# EAGLE design water_buzzer (EAGLE 9.4.2)
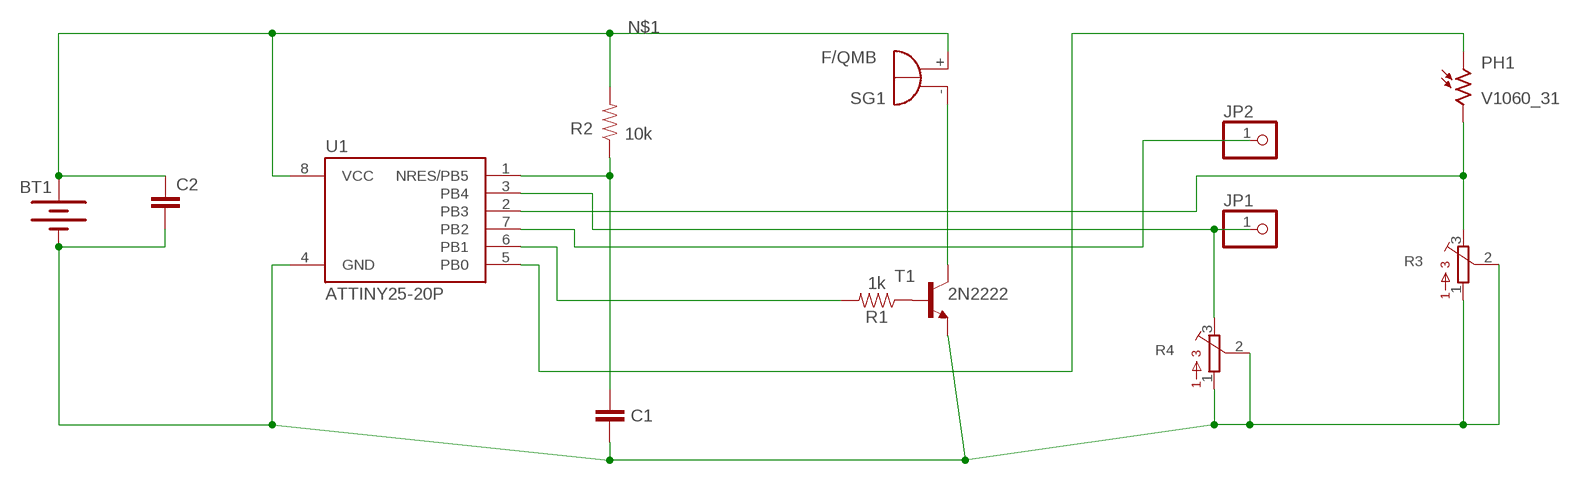
[diagram p0: schematic, sheet 1]

## Parts
BT1  BATTERY-20MM_PTH  [BATTCOM_20MM_PTH]
C1  C5/2.5  [C5B2.5]
C2  C5/2.5  [C5B2.5]
JP1  PINHD-1X1  [1X01]
JP2  PINHD-1X1  [1X01]
PH1  V1060_31  [TO-5_V10]
R1  1k  1KOHM-HORIZ-1/4W-5%  [AXIAL-0.3]
R2  10k  10KOHM-HORIZ-1/4W-5%  [AXIAL-0.3]
R3  3362R  [3362R]
R4  3362R  [3362R]
SG1  F/QMB  [F/QMB]
T1  2N2222  [TO92-EBC-OVAL]
U1  ATTINY25-20P  [PDIP08_300MIL]

## Nets
N$1: BT1.1(+) C2.1 R2.P$2 SG1.+(-) U1.8(VCC)
N$2: BT1.2(-) C1.1 C2.2 R3.1 R3.2 R4.1 R4.2 T1.E U1.4(GND)
N$3: C1.2 R2.P$1 U1.1(NRES/PB5)
N$4: JP2.1 U1.7(PB2)
N$5: R1.P$1 T1.B
N$6: JP1.1 R4.3 U1.3(PB4)
N$7: SG1.-(+) T1.C
N$8: R1.P$2 U1.6(PB1)
N$9: PH1.1 U1.5(PB0)
N$10: PH1.2 R3.3 U1.2(PB3)

## Library data of the parts
BT1 = SparkFun-Batteries:BATTERY: Battery - Single Cell A variety of battery chemistries, sizes, and footprints. Device List: 20MM_PTH - Coin Cell Battery Holder - 20mm (PTH) <https://www.sparkfun.com/products/783> 20MM_PTH_KIT- Coin Cell battery Holder - 20 mm (PTH) <http://www.sparkfun.com/products/783>kit version with special mask 6.8MM_PTH - Coin Cell Battery Holder - 6.8MM(SMD) <https://www.digikey.com/product-detail/en/seiko-instruments/MS621FE-FL11E/728-1057-ND/1889208?WT.srch=1&gclid=CNOQ5a6LzdQCFZS2wAodXCkE0g> 12MM_SMD - Coin Cell Battery Holder - 12mm (SMD) <https://www.sparkfun.com/products/10592> 12MM_PTH - Coin Cell Battery Holder - 12mm (PTH) <https://www.sparkfun.com/products/7948> 20MM_SMD - 20mm Coin Cell Battery Holder (SMD) (2 legs) Used on the Big Time Watch Kit <https://www.sparkfun.com/products/11734> 20MM_SMD_4LEGS - Coin Cell Battery Holder - 20mm (SMD) <https://www.sparkfun.com/products/11892> 20MM_SMD_4LEGS_OVERPASTE - Coin Cell Battery Holder - 20mm (SMD) <https://www.sparkfun.com/products/11892> (Over-paste on the legs) 24.5MM_PTH - Coin Cell Battery Holder - 24.5mm (PTH) <https://www.sparkfun.com/products/8863> 9V - 9V Battery Holder - PC Mount Used on the SparkFun SparkPunk Sound Kit <https://www.sparkfun.com/products/11177> and SparkFun SparkPunk Sequencer Kit <https://www.sparkfun.com/products/12707> 18650 - Battery Holder - 18650 (PTH) <https://www.sparkfun.com/products/13113> AA - Battery Holder - 1xAA (PTH) <https://www.sparkfun.com/products/7949> AAA - Battery Holder - 1xAAA (PTH) <https://www.sparkfun.com/products/12718> AA_KIT - Battery Holder - 1xAA (PTH) <https://www.sparkfun.com/products/7949> Special kit package - pads only have exposed copper on one side of the board. AAA_KIT - Battery Holder - 1xAAA (PTH) <https://www.sparkfun.com/products/12718> Special kit package - pads only have exposed copper on one side of the board.; PROD_ID: BATT-09031; SF_SKU: PRT-00783
C1 C2 = capacitor-wima:C: CAPACITOR naming: grid - package width
JP1 JP2 = adafruit:PINHD-1X1: Pin header 1x1 for 0.1" spacing With round pins
PH1 = photo-elements:?1060*: Sensor Street Light control Source: http://optoelectronics.perkinelmer.com/content/Datasheets/DTS_PhotocellsB1060.pdf
R1 = SparkFun-Resistors:1KOHM: 1kΩ resistor A resistor is a passive two-terminal electrical component that implements electrical resistance as a circuit element. Resistors act to reduce current flow, and, at the same time, act to lower voltage levels within circuits. - Wikipedia; PROD_ID: RES-08380
R2 = SparkFun-Resistors:10KOHM: 10kΩ resistor A resistor is a passive two-terminal electrical component that implements electrical resistance as a circuit element. Resistors act to reduce current flow, and, at the same time, act to lower voltage levels within circuits. - Wikipedia; PROD_ID: RES-09435
R3 R4 = bourns:3362: 3362 Series 1/4" Square Trimmer
SG1 = buzzer:F/QMB: BUZZER Source: Buerklin; OC_FARNELL: unknown; OC_NEWARK: unknown
T1 = adafruit:2N2222: NPN TRANSISTOR Big oval pads
U1 = _hhn_attiny25_45_85:ATTINY25*: ATMEL ATtiny 25 Packages: P = PDIP 08 30mil S = SOIC 08 EIAJ 208mil SS = SOIC 08 JEDEC 150mil Technologies Note: for complete ordering code (temp. range, finish, tape&reel etc.) see www.atmel.com • Supply Voltage: V = (1.8…5.5)V | [blank] = (2.7…5.5)V • Speed: 10 = 10 MHz | 20 = 20 MHz Author: Dipl.-Ing. FH Rainer Bayer HHN Hochschule Heilbronn (Heilbronn University), rainer.bayer@hs-heilbronn.de Ingenieurbüro ing-rb, mail@ing-rb.de

## Board
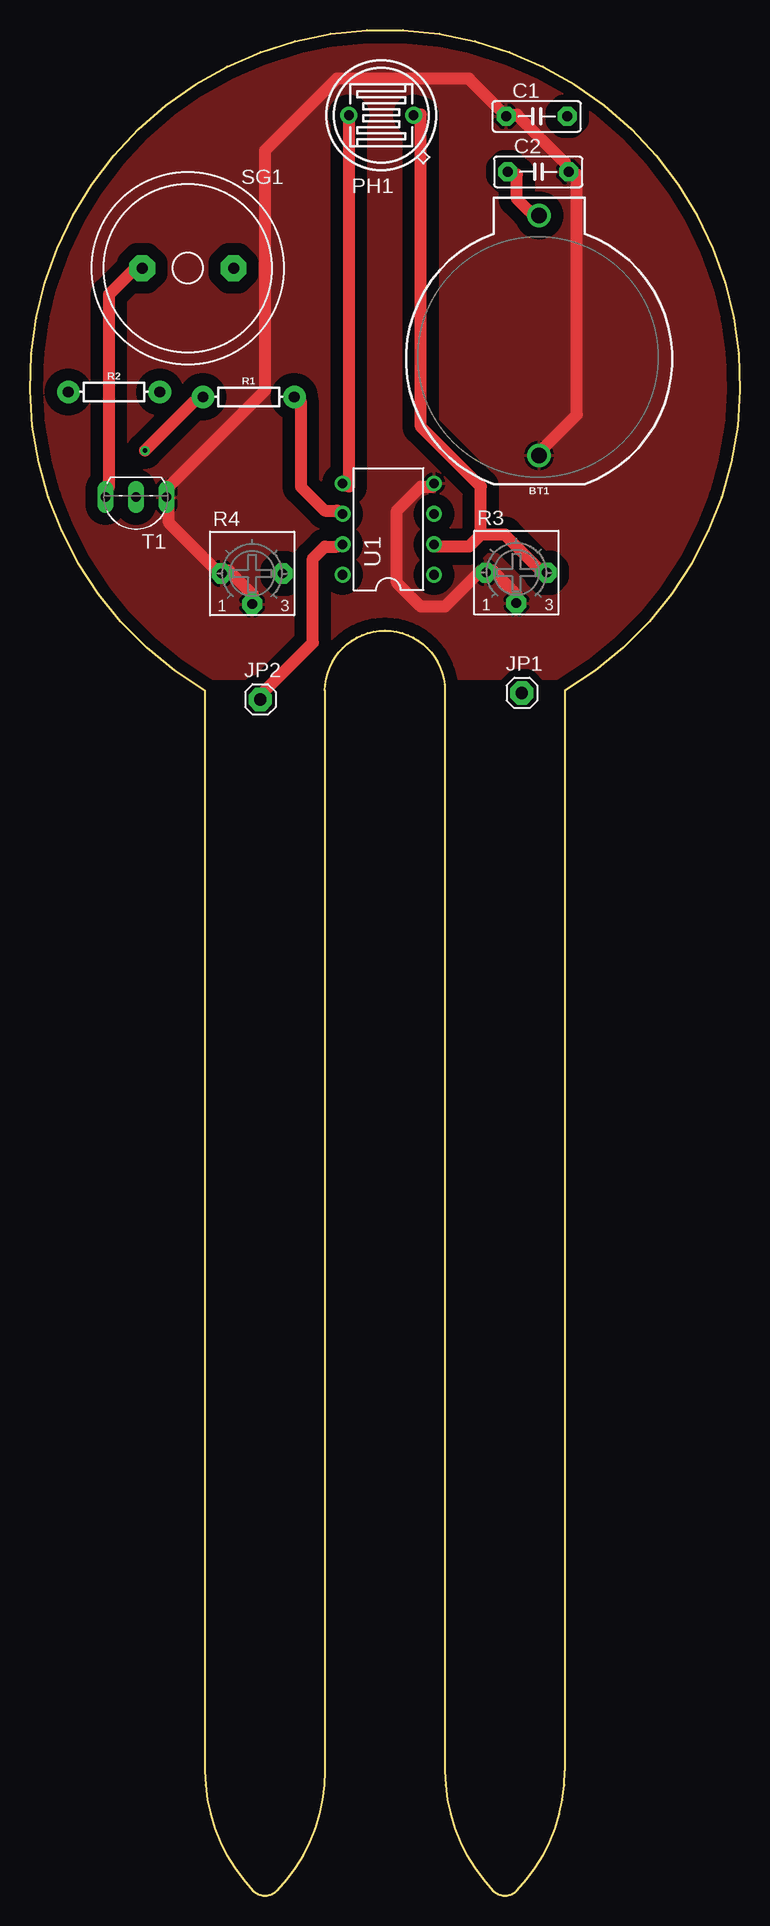
[diagram p1: board, top side]
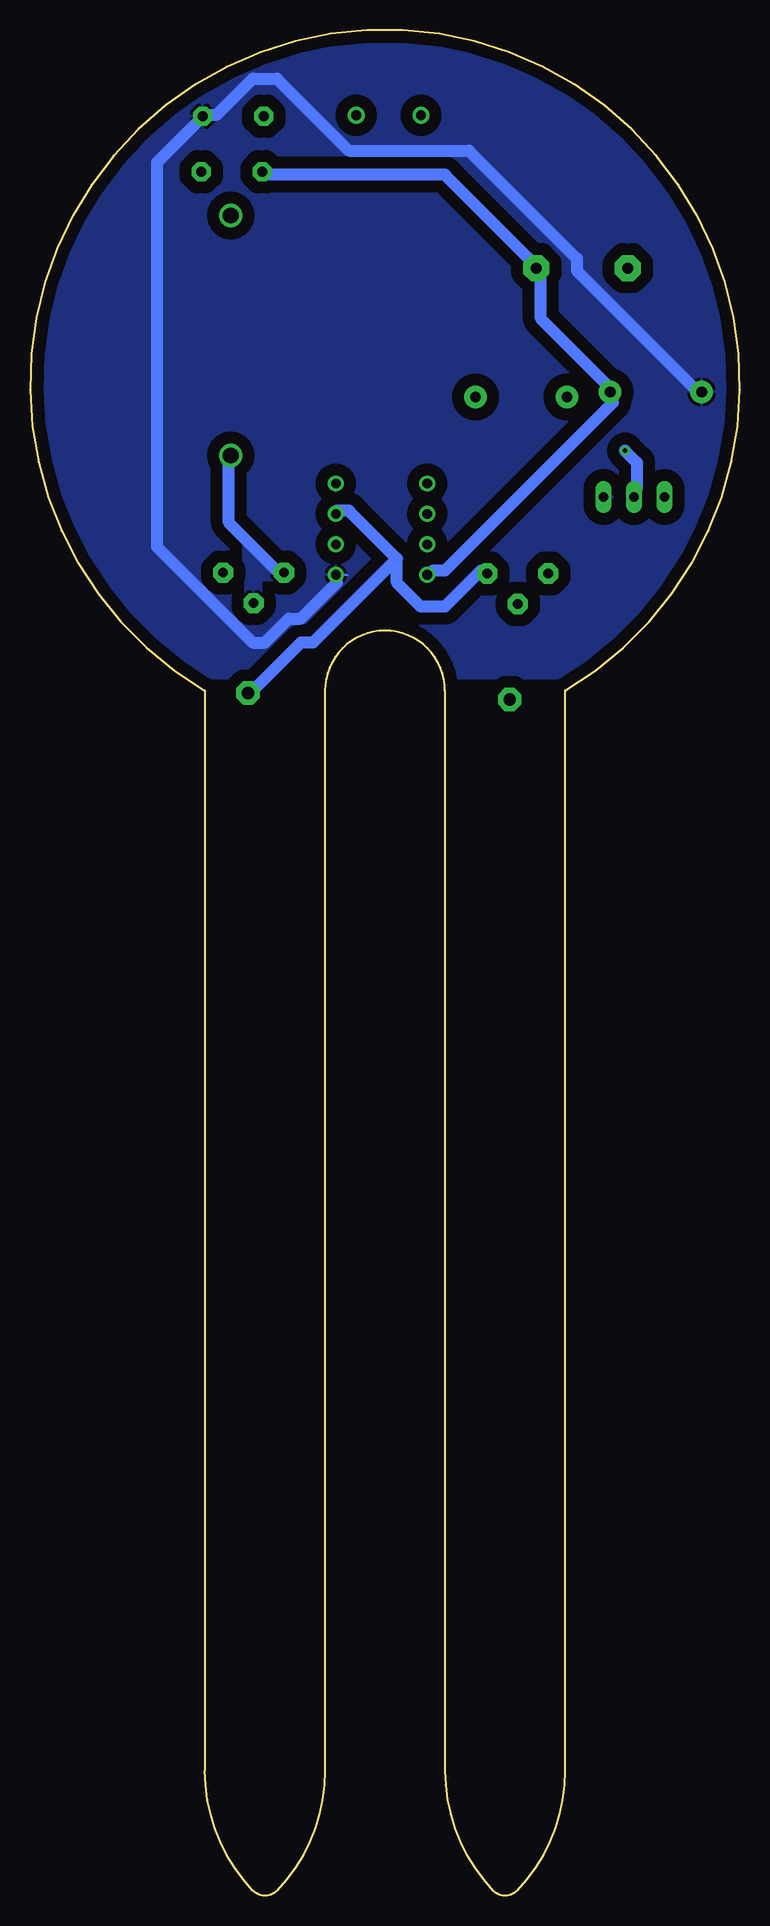
[diagram p2: board, bottom side, seen from below]

Size 59.16 x 155.47 mm. Coordinates in mm from the lower left corner, seen from the top.
Outline: 14.58,100.43 14.58,10.43 arc44 18.58,0.43 arc93 20.58,0.43 arc44 24.58,10.43 24.58,100.43 arc-180 34.58,100.43 34.58,10.43 arc44 38.58,0.43 arc93 40.58,0.43 arc44 44.58,10.43 44.58,100.43 arc299 14.58,100.43
Copper layers (1*16): Top 0.035mm / dielectric 1.5mm / Bottom 0.035mm
Design rules "default *": minimum track width 1mm, minimum drill 0.35mm, track to track 1mm, track to pad 1mm, pad to pad 6mil, via to via 6mil, smd to smd 6mil, copper to edge 1mm, drill to drill 1mm, minimum pad ring 10mil, minimum via ring 8mil, stop-mask expansion 4mil, vias tented up to drill 0mil, thermal gap 10mil

### Footprints (pad centres in the part's own frame; a part is rotated, then mirrored left to right if it is on the bottom)
BATTCOM_20MM_PTH = drill 1.3: 1 11.85,0; 2 -8.15,0
C5B2.5 = drill 0.813 pad 1.6 octagon: 1 -2.54,0; 2 2.54,0
1X01 = drill 1.016 pad 1.93 octagon: 1 0,0
TO-5_V10 = drill 0.8 pad 1.4: 1 -2.7,0; 2 2.7,0
AXIAL-0.3 = drill 0.9 pad 1.88: P$1 -3.81,0; P$2 3.81,0
3362R = drill 0.813 pad 1.676 octagon: 1 -2.54,0; 2 0,-2.54; 3 2.54,0
F/QMB = drill 0.914 pad 2.159 octagon: + 3.81,0; - -3.81,0
TO92-EBC-OVAL = drill 0.813 long: B 0,-1.27; C 2.54,-1.27; E -2.54,-1.27
PDIP08_300MIL = drill 0.813: 1 -3.81,-3.81; 2 -1.27,-3.81; 3 1.27,-3.81; 4 3.81,-3.81; 5 3.81,3.81; 6 1.27,3.81; 7 -1.27,3.81; 8 -3.81,3.81

### Placement (x,y rotation side)
BT1  42.43,128.17 90 top
C1  42.22,148.28 0 top
C2  42.35,143.66 0 top
JP1  40.99,100.23 0 top
JP2  19.19,99.69 0 top
PH1  29.27,148.37 0 top
R1  18.22,124.9 0 top
R2  7,125.31 0 top
R3  40.53,110.26 0 top
R4  18.51,110.18 0 top
SG1  13.15,135.63 0 top
T1  8.83,115.28 180 top
U1  29.86,113.88 90 top

### Tracks (layer width: path | path; a pad name or v marks a point on that pad's centre or on a via)
N$1
  Top 1: C2.1 40.58,143.43 40.58,141.43 41.58,140.43 BT1.1
  Bottom 0.152: 26.01,110.18 U1.8
  Bottom 1: U1.8 25.58,110.43 24.58,110.43 10.58,124.43 R2.P$2 10.58,125.43 16.58,131.43 16.58,135.43 SG1.+ 17.58,136.43 24.58,143.43 39.58,143.43 C2.1
N$2
  Top 0.152: 18.39,107.74 R4.2 | 16.11,110.03 R4.1 | 42.47,120.09 BT1.2 | 33.63,117.65 U1.4
  Top 1: R4.2 18.58,108.43 16.58,110.43 R4.1 15.58,110.43 11.58,114.43 11.58,116.43 T1.E 11.58,117.43 19.58,125.43 19.58,145.43 25.58,151.43 36.58,151.43 39.58,148.43 | 39.58,148.43 40.58,148.43 44.58,144.43 C2.2 45.58,143.43 45.58,123.43 42.58,120.43 BT1.2 | U1.4 33.58,117.43 32.58,117.43 30.58,115.43 30.58,109.43 32.58,107.43 34.58,107.43 37.58,110.43 R3.1 38.58,110.43 40.58,108.43 R3.2 | 39.58,148.43 C1.1
  Bottom 0.152: 33.78,117.65 U1.4 | 37.9,110.33 R3.1 | 42.32,119.93 BT1.2
  Bottom 1: BT1.2 42.58,119.43 42.58,114.43 38.58,110.43 R3.1
  pour Top (isolate 1.016): -1.42,101.43 59.17,101.43 arc45 59.87,101.72 66.58,108.43 66.58,135.01 arc45 66.29,135.72 41.58,160.43 7,160.43 arc45 6.29,160.13 -6.42,147.43 -6.42,106.84 arc45 -6.13,106.13
  pour Bottom (rank 6): 2.58,102.43 3.29,101.72 arc45 4,101.43 58.58,101.43 63.29,106.13 arc45 63.58,106.84 63.58,150.43 57.87,156.13 arc45 57.17,156.43 4.58,156.43 -2.13,149.72 arc45 -2.42,149.01 -2.42,104.43 -0.71,102.72 arc45 0,102.43
N$3
  Bottom 0.152: 32.72,110.03 33.63,110.03 U1.1
  Bottom 1: 44.58,148.43 48.58,144.43 48.58,112.43 40.58,104.43 39.58,104.43 37.58,106.43 36.58,106.43 33.58,109.43 U1.1 | 44.58,148.43 43.58,148.43 40.58,151.43 38.58,151.43 32.58,145.43 22.58,145.43 13.58,136.43 13.58,135.43 3.58,125.43 R2.P$1 | 44.58,148.43 C1.2
  pour Bottom: -6.42,103.43 -4.71,101.72 arc45 -4,101.43 63.58,101.43 65.29,103.13 arc45 65.58,103.84 65.58,152.43 62.87,155.13 arc45 62.17,155.43 7.58,155.43 -6.13,141.72 arc45 -6.42,141.01
N$4
  Top 0.152: 26.01,112.47 U1.7 | 19.31,99.82 JP2.1
  Top 1: U1.7 25.58,112.43 24.58,112.43 23.58,111.43 23.58,104.43 19.58,100.43 JP2.1
N$5  (via drill 0.35)
  Top 1: v9.58,120.43 13.58,124.43 R1.P$1
  Bottom 1: v9.58,120.43 8.58,119.43 8.58,117.43 T1.B
N$6
  Top 0.152: 33.63,115.06 U1.3 | 21.13,110.18 R4.3
  Bottom 0.152: 40.95,100.28 JP1.1 | 33.78,115.06 U1.3
  Bottom 1: 28.58,111.43 32.58,115.43 33.58,115.43 U1.3 | 28.58,111.43 28.58,109.43 26.58,107.43 24.58,107.43 21.58,110.43 R4.3 | 28.58,111.43 35.58,104.43 36.58,104.43 40.58,100.43 JP1.1
N$7
  Top 1: T1.C 6.58,117.43 6.58,133.43 8.58,135.43 SG1.-
N$8
  Top 1: U1.6 25.58,115.43 24.58,115.43 22.58,117.43 22.58,124.43 R1.P$2
  Bottom 0.152: 26.16,115.21 U1.6
N$9
  Top 1: U1.5 26.58,117.43 26.58,148.43 PH1.1
N$10
  Top 0.152: 33.78,112.47 U1.2
  Top 1: 37.58,113.43 36.58,112.43 33.58,112.43 U1.2 | 37.58,113.43 39.58,113.43 42.58,110.43 R3.3 | 37.58,113.43 37.58,117.43 32.58,122.43 32.58,148.43 PH1.2
S$1
  Top 0.152: 16.42,135.63 16.41,135.63